# EAGLE design LACE_mod_hbridge (EAGLE 5.09)
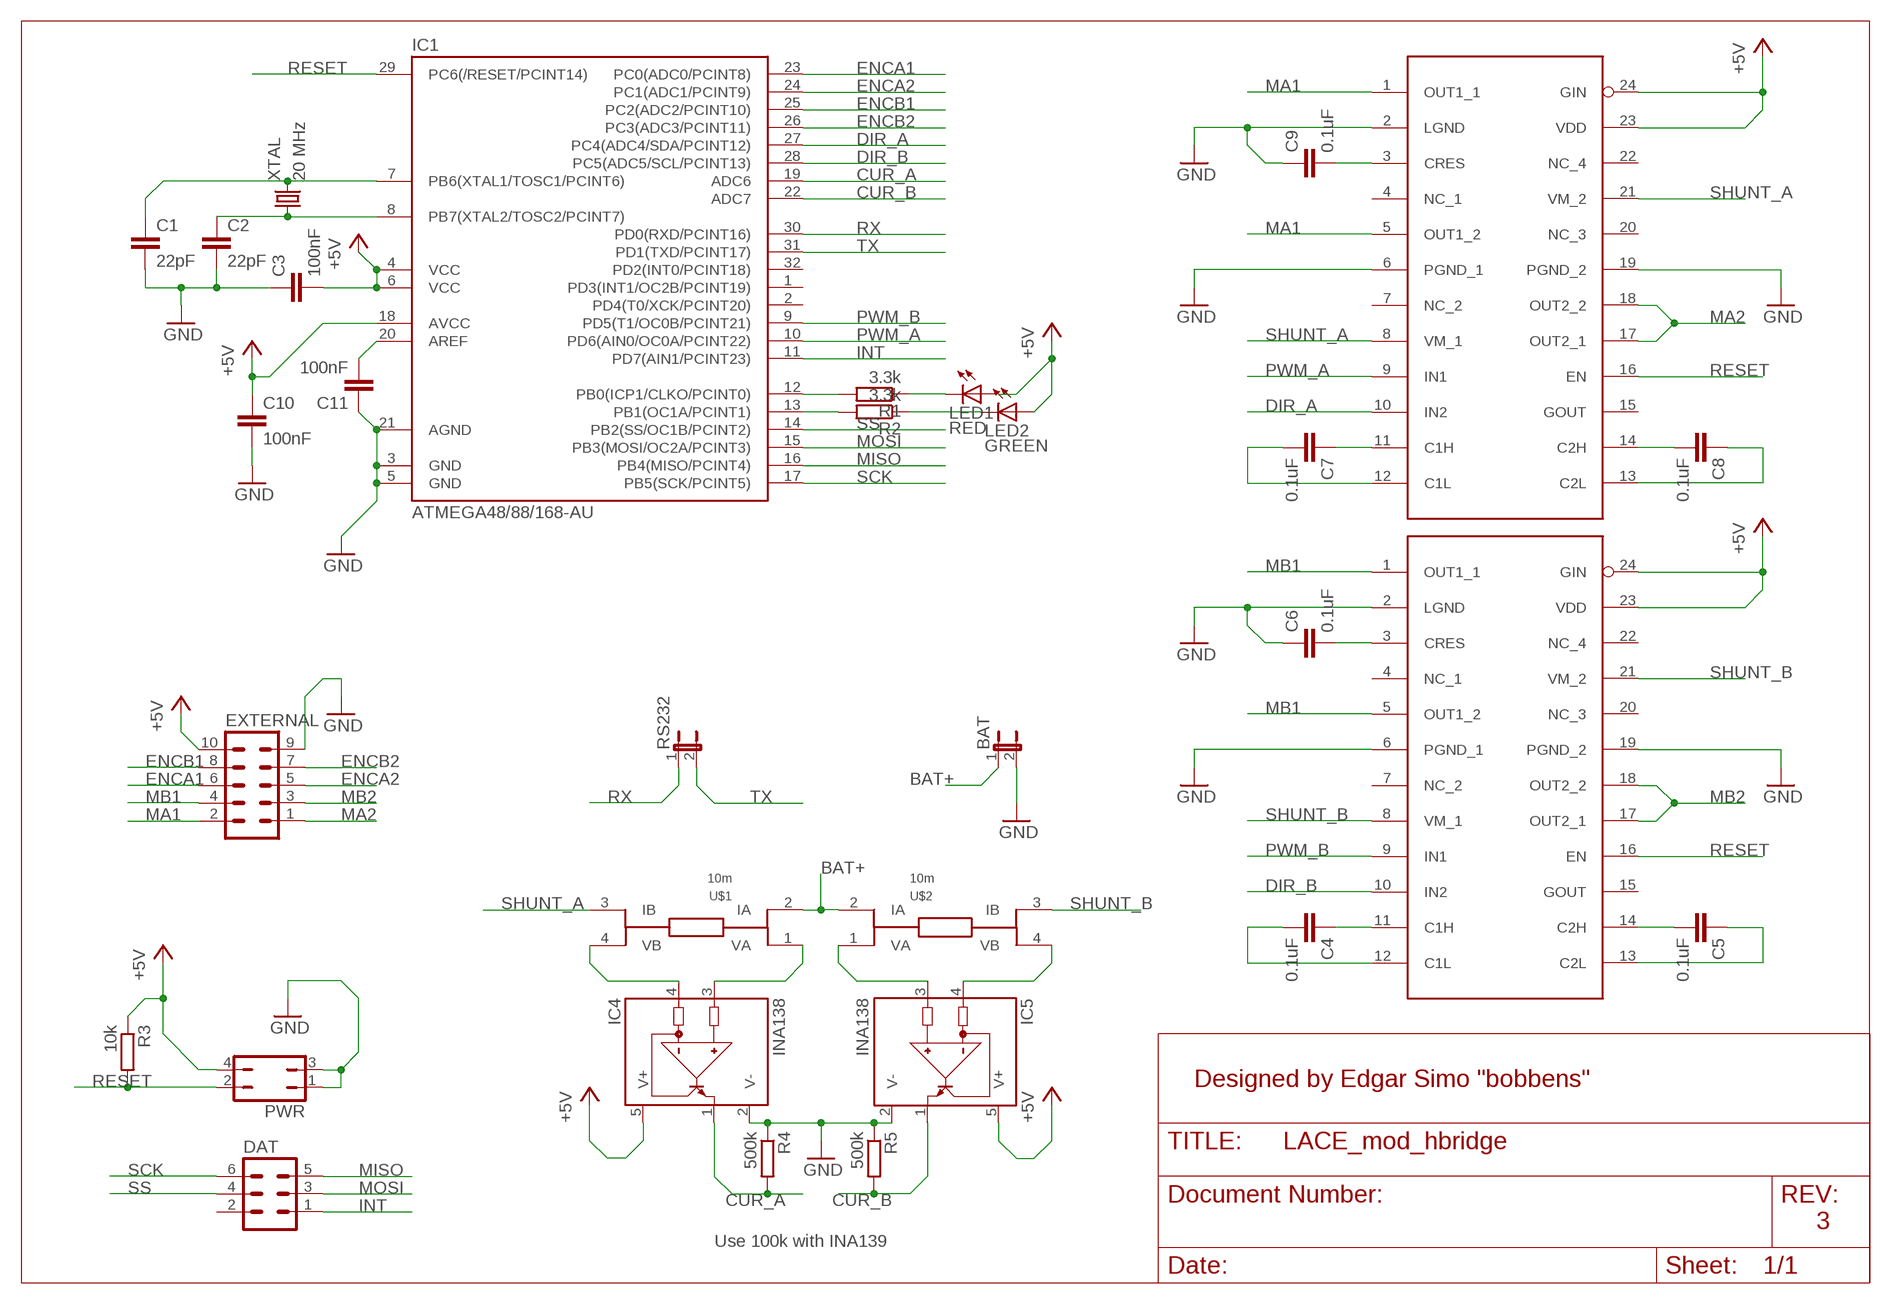
[diagram p0: schematic, sheet 1]

## Parts
BAT  JP1E  [JP1]
C1  22pF  C-EUC0805K  [C0805K]
C2  22pF  C-EUC0805K  [C0805K]
C3  100nF  C-EUC0805K  [C0805K]
C4  0.1uF  C-EUC0805K  [C0805K]
C5  0.1uF  C-EUC0805K  [C0805K]
C6  0.1uF  C-EUC0805K  [C0805K]
C7  0.1uF  C-EUC0805K  [C0805K]
C8  0.1uF  C-EUC0805K  [C0805K]
C9  0.1uF  C-EUC0805K  [C0805K]
C10  100nF  C-EUC0805K  [C0805K]
C11  100nF  C-EUC0805K  [C0805K]
DAT  MA03-2  [MA03-2]
EXTERNAL  MA05-2  [MA05-2]
IC1  ATMEGA48/88/168-AU  [TQFP32-08]
IC2  MPC17510  [TSSOP24]
IC3  MPC17510  [TSSOP24]
IC4  INA138  [SOT23-5]
IC5  INA138  [SOT23-5]
LED1  RED  LEDCHIPLED_0805  [CHIPLED_0805]
LED2  GREEN  LEDCHIPLED_0805  [CHIPLED_0805]
PWR  JP2Q  [JP2Q]
R1  3.3k  R-EU_R0805  [R0805]
R2  3.3k  R-EU_R0805  [R0805]
R3  10k  R-EU_R0805  [R0805]
R4  500k  R-EU_R0805  [R0805]
R5  500k  R-EU_R0805  [R0805]
RS232  JP1E  [JP1]
U$1  10m  LVK20R  [LVK20]
U$2  10m  LVK20R  [LVK20]
XTAL  20 MHz  CRYSTALHC49S  [HC49/S]

## Nets
+5V: C3.2 C10.1 EXTERNAL.10 IC1.4(VCC) IC1.6(VCC) IC1.18(AVCC) IC2.23(VDD) IC2.24(GIN) IC3.23(VDD) IC3.24(GIN) IC4.5(V+) IC5.5(V+) LED1.A LED2.A PWR.4 R3.1
BAT+: BAT.1 U$1.2(IA) U$2.2(IA)
CUR_A: IC1.19(ADC6) IC4.1(OUT) R4.2
CUR_B: IC1.22(ADC7) IC5.1(OUT) R5.2
DIR_A: IC1.27(PC4(ADC4/SDA/PCINT12)) IC2.10(IN2)
DIR_B: IC1.28(PC5(ADC5/SCL/PCINT13)) IC3.10(IN2)
ENCA1: EXTERNAL.6 IC1.23(PC0(ADC0/PCINT8))
ENCA2: EXTERNAL.5 IC1.24(PC1(ADC1/PCINT9))
ENCB1: EXTERNAL.8 IC1.25(PC2(ADC2/PCINT10))
ENCB2: EXTERNAL.7 IC1.26(PC3(ADC3/PCINT11))
GND: BAT.2 C1.2 C2.2 C3.1 C6.1 C9.1 C10.2 C11.1 EXTERNAL.9 IC1.3(GND) IC1.5(GND) IC1.21(AGND) IC2.2(LGND) IC2.6(PGND_1) IC2.19(PGND_2) IC3.2(LGND) IC3.6(PGND_1) IC3.19(PGND_2) IC4.2(V-) IC5.2(V-) PWR.1 PWR.3 R4.1 R5.1
INT: DAT.1 IC1.11(PD7(AIN1/PCINT23))
MA1: EXTERNAL.2 IC2.1(OUT1_1) IC2.5(OUT1_2)
MA2: EXTERNAL.1 IC2.17(OUT2_1) IC2.18(OUT2_2)
MB1: EXTERNAL.4 IC3.1(OUT1_1) IC3.5(OUT1_2)
MB2: EXTERNAL.3 IC3.17(OUT2_1) IC3.18(OUT2_2)
MISO: DAT.5 IC1.16(PB4(MISO/PCINT4))
MOSI: DAT.3 IC1.15(PB3(MOSI/OC2A/PCINT3))
N$1: C1.1 IC1.7(PB6(XTAL1/TOSC1/PCINT6)) XTAL.2
N$2: IC4.4(IN-) U$1.4(VB)
N$3: C7.1 IC2.11(C1H)
N$4: C7.2 IC2.12(C1L)
N$5: C8.2 IC2.14(C2H)
N$6: C8.1 IC2.13(C2L)
N$7: C4.1 IC3.11(C1H)
N$8: C9.2 IC2.3(CRES)
N$9: C4.2 IC3.12(C1L)
N$10: C5.2 IC3.14(C2H)
N$11: C5.1 IC3.13(C2L)
N$12: C6.2 IC3.3(CRES)
N$13: IC1.12(PB0(ICP1/CLKO/PCINT0)) R1.2
N$14: IC1.13(PB1(OC1A/PCINT1)) R2.2
N$15: LED1.C R1.1
N$16: LED2.C R2.1
N$17: IC4.3(IN+) U$1.1(VA)
N$18: IC5.3(IN+) U$2.1(VA)
N$19: IC5.4(IN-) U$2.4(VB)
N$22: C11.2 IC1.20(AREF)
N$24: C2.1 IC1.8(PB7(XTAL2/TOSC2/PCINT7)) XTAL.1
PWM_A: IC1.10(PD6(AIN0/OC0A/PCINT22)) IC2.9(IN1)
PWM_B: IC1.9(PD5(T1/OC0B/PCINT21)) IC3.9(IN1)
RESET: IC1.29(PC6(/RESET/PCINT14)) IC2.16(EN) IC3.16(EN) PWR.2 R3.2
RX: IC1.30(PD0(RXD/PCINT16)) RS232.1
SCK: DAT.6 IC1.17(PB5(SCK/PCINT5))
SHUNT_A: IC2.8(VM_1) IC2.21(VM_2) U$1.3(IB)
SHUNT_B: IC3.8(VM_1) IC3.21(VM_2) U$2.3(IB)
SS: DAT.4 IC1.14(PB2(SS/OC1B/PCINT2))
TX: IC1.31(PD1(TXD/PCINT17)) RS232.2
Unconnected: DAT.2 IC1.1(PD3(INT1/OC2B/PCINT19)) IC1.2(PD4(T0/XCK/PCINT20)) IC1.32(PD2(INT0/PCINT18)) IC2.4(NC_1) IC2.7(NC_2) IC2.15(GOUT) IC2.20(NC_3) IC2.22(NC_4) IC3.4(NC_1) IC3.7(NC_2) IC3.15(GOUT) IC3.20(NC_3) IC3.22(NC_4)

## Notes on the sheet
- Designed by Edgar Simo "bobbens"
- 3
- Use 100k with INA139

## Library data of the parts
BAT RS232 = jumper:JP1E: JUMPER
C1-C11 = rcl:C-EU: CAPACITOR, European symbol
DAT = con-lstb:MA03-2: PIN HEADER
EXTERNAL = con-lstb:MA05-2: PIN HEADER
IC1 = atmega8:ATMEGA48/88/168
IC2 IC3 = mpc17510:MPC17510
IC4 IC5 = burr-brown:INA138: High-Side Measurement Current Shunt Monitor
LED1 LED2 = led:LED: LED OSRAM: - CHIPLED LG R971, LG N971, LY N971, LG Q971, LY Q971, LO R971, LY R971 LH N974, LH R974 LS Q976, LO Q976, LY Q976 LO Q996 - Hyper CHIPLED LW Q18S LB Q993, LB Q99A, LB R99A - SideLED LS A670, LO A670, LY A670, LG A670, LP A670 LB A673, LV A673, LT A673, LW A673 LH A674 LY A675 LS A676, LA A676, LO A676, LY A676, LW A676 LS A679, LY A679, LG A679 - Hyper Micro SIDELED® LS Y876, LA Y876, LO Y876, LY Y876 LT Y87S - SmartLED LW L88C, LW L88S LB L89C, LB L89S, LG L890 LS L89K, LO L89K, LY L89K LS L896, LA L896, LO L896, LY L896 - TOPLED LS T670, LO T670, LY T670, LG T670, LP T670 LSG T670, LSP T670, LSY T670, LOP T670, LYG T670 LG T671, LOG T671, LSG T671 LB T673, LV T673, LT T673, LW T673 LH T674 LS T676, LA T676, LO T676, LY T676, LB T676, LH T676, LSB T676, LW T676 LB T67C, LV T67C, LT T67C, LS T67K, LO T67K, LY T67K, LW E67C LS E67B, LA E67B, LO E67B, LY E67B, LB E67C, LV E67C, LT E67C LW T67C LS T679, LY T679, LG T679 LS T770, LO T770, LY T770, LG T770, LP T770 LB T773, LV T773, LT T773, LW T773 LH T774 LS E675, LA E675, LY E675, LS T675 LS T776, LA T776, LO T776, LY T776, LB T776 LHGB T686 LT T68C, LB T68C - Hyper Mini TOPLED® LB M676 - Mini TOPLED Santana® LG M470 LS M47K, LO M47K, LY M47K Source: http://www.osram.convergy.de LUXEON: - LUMILED® LXK2-PW12-R00, LXK2-PW12-S00, LXK2-PW14-U00, LXK2-PW14-V00 LXK2-PM12-R00, LXK2-PM12-S00, LXK2-PM14-U00 LXK2-PE12-Q00, LXK2-PE12-R00, LXK2-PE12-S00, LXK2-PE14-T00, LXK2-PE14-U00 LXK2-PB12-K00, LXK2-PB12-L00, LXK2-PB12-M00, LXK2-PB14-N00, LXK2-PB14-P00, LXK2-PB14-Q00 LXK2-PR12-L00, LXK2-PR12-M00, LXK2-PR14-Q00, LXK2-PR14-R00 LXK2-PD12-Q00, LXK2-PD12-R00, LXK2-PD12-S00 LXK2-PH12-R00, LXK2-PH12-S00 LXK2-PL12-P00, LXK2-PL12-Q00, LXK2-PL12-R00 Source: www.luxeon.com KINGBRIGHT: KA-3528ASYC Source: www.kingbright.com
PWR = jumper:JP2Q: JUMPER
R1-R5 = rcl:R-EU_: RESISTOR, European symbol
U$1 U$2 = bobbens:LVK20R: Resistor Four Terminal High Precision Current Sense Kelvin Configuration
XTAL = crystal:CRYSTAL: CRYSTAL

## Board
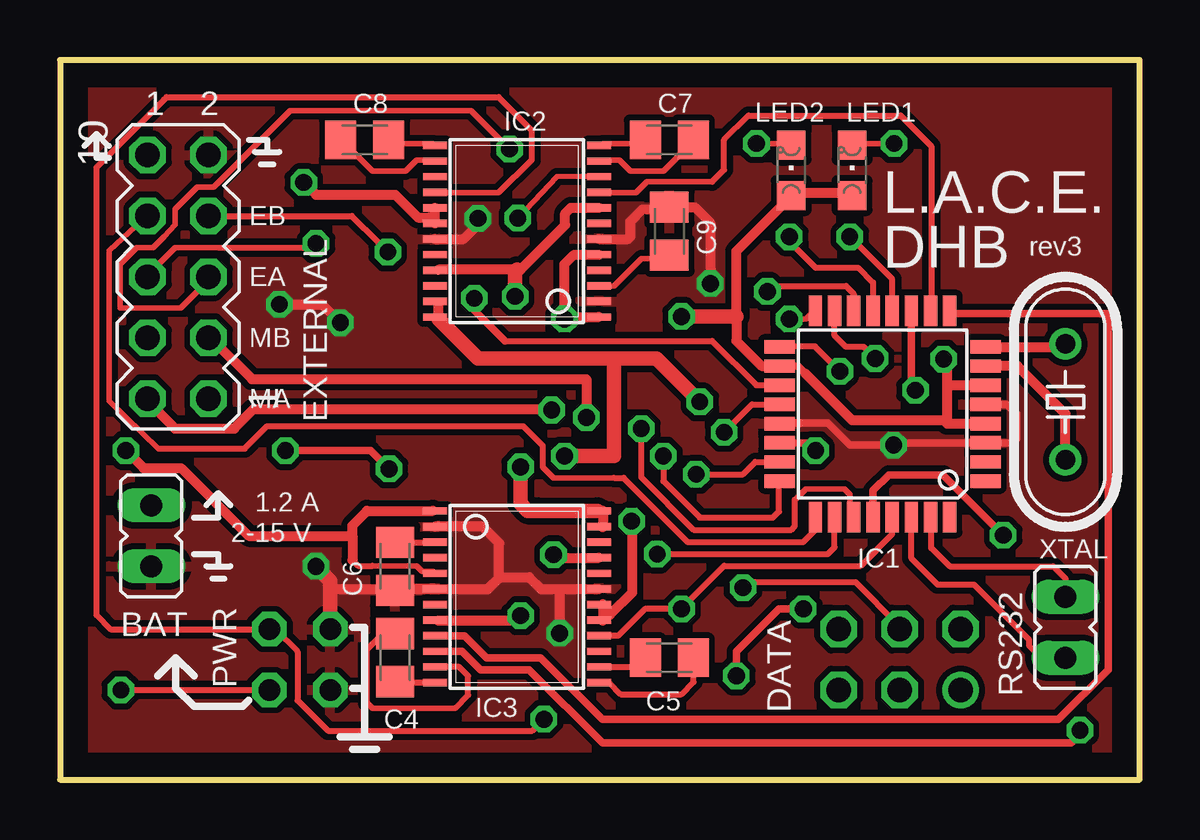
[diagram p1: board, top side]
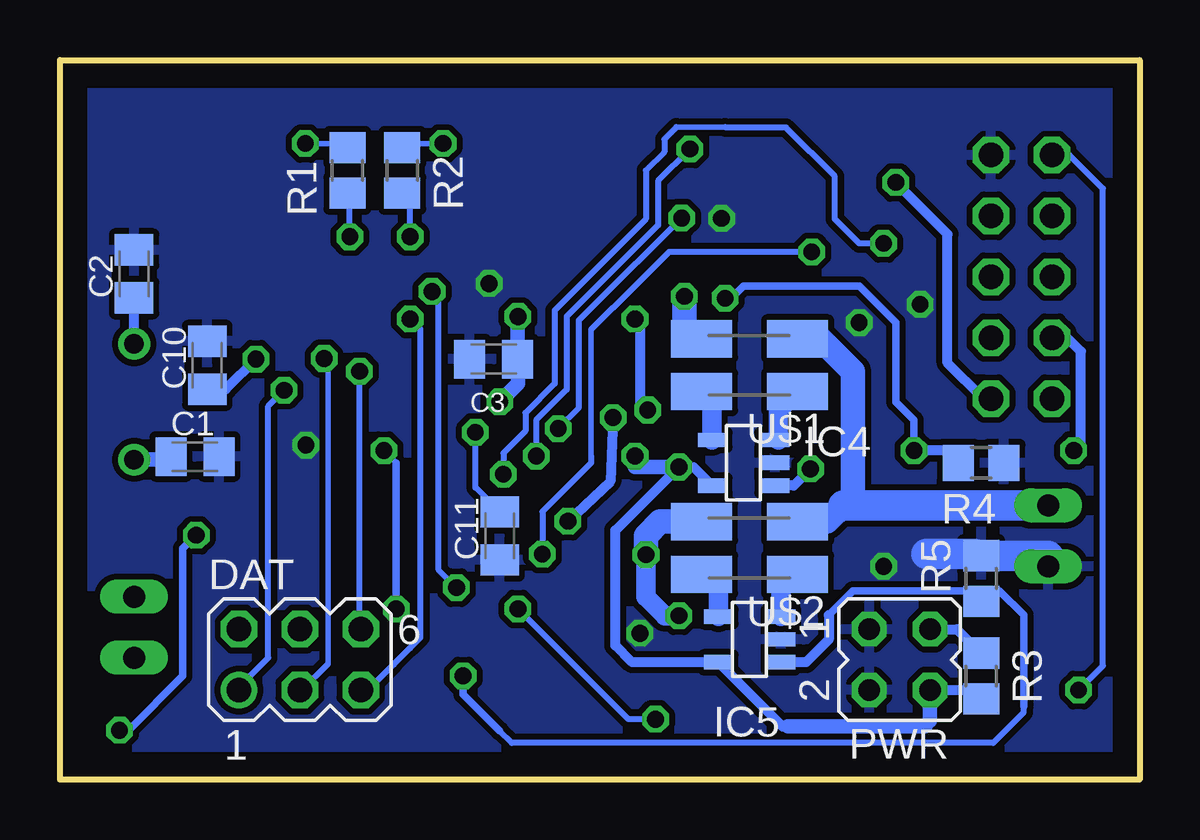
[diagram p2: board, bottom side, seen from below]

Size 45 x 30 mm. Coordinates in mm from the lower left corner, seen from the top.
Outline: 0,0 45,0 45,30 0,30 0,0
Copper layers (1*16): Top 0.035mm / dielectric 1.5mm / Bottom 0.035mm
Design rules "olimex-8mils *": minimum track width 8mil, minimum drill 0.7mm, track to track 8mil, track to pad 8mil, pad to pad 8mil, via to via 8mil, smd to smd 8mil, copper to edge 40mil, drill to drill 10mil, minimum pad ring 10mil, minimum via ring 8mil, stop-mask expansion 0mil, vias tented up to drill 0mil, thermal gap 10mil

### Footprints (pad centres in the part's own frame; a part is rotated, then mirrored left to right if it is on the bottom)
JP1 = drill 0.914 long: 1 0,-1.27; 2 0,1.27
C0805K = smd 1.3 x 1.6: 1 -1,0; 2 1,0
MA03-2 = drill 1.016 round: 1 -2.54,-1.27 | drill 1.016 octagon: 2 -2.54,1.27; 3 0,-1.27; 4 0,1.27; 5 2.54,-1.27; 6 2.54,1.27
MA05-2 = drill 1.016 octagon: 1 -5.08,-1.27; 2 -5.08,1.27; 3 -2.54,-1.27; 4 -2.54,1.27; 5 0,-1.27; 6 0,1.27; 7 2.54,-1.27; 8 2.54,1.27; 9 5.08,-1.27; 10 5.08,1.27
TQFP32-08 = smd 1.27 x 0.559: 1 -4.293,2.8; 2 -4.293,2; 3 -4.293,1.2; 4 -4.293,0.4; 5 -4.293,-0.4; 6 -4.293,-1.2; 7 -4.293,-2; 8 -4.293,-2.8; 17 4.293,-2.8; 18 4.293,-2; 19 4.293,-1.2; 20 4.293,-0.4; 21 4.293,0.4; 22 4.293,1.2; 23 4.293,2; 24 4.293,2.8 | smd 0.559 x 1.27: 9 -2.8,-4.293; 10 -2,-4.293; 11 -1.2,-4.293; 12 -0.4,-4.293; 13 0.4,-4.293; 14 1.2,-4.293; 15 2,-4.293; 16 2.8,-4.293; 25 2.8,4.293; 26 2,4.293; 27 1.2,4.293; 28 0.4,4.293; 29 -0.4,4.293; 30 -1.2,4.293; 31 -2,4.293; 32 -2.8,4.293
TSSOP24 = smd 0.305 x 0.991: 1 -3.575,-3.418; 2 -2.925,-3.418; 3 -2.275,-3.418; 4 -1.625,-3.418; 5 -0.975,-3.418; 6 -0.325,-3.418; 7 0.325,-3.418; 8 0.975,-3.418; 9 1.625,-3.418; 10 2.275,-3.418; 11 2.925,-3.418; 12 3.575,-3.418; 13 3.575,3.418; 14 2.925,3.418; 15 2.275,3.418; 16 1.625,3.418; 17 0.975,3.418; 18 0.325,3.418; 19 -0.325,3.418; 20 -0.975,3.418; 21 -1.625,3.418; 22 -2.275,3.418; 23 -2.925,3.418; 24 -3.575,3.418
SOT23-5 = smd 0.6 x 1.2: 1 -0.95,-1.306; 2 0,-1.306; 3 0.95,-1.306; 4 0.95,1.306; 5 -0.95,1.306
CHIPLED_0805 = smd 1.2 x 1.2: A 0,-1.05; C 0,1.05
JP2Q = drill 0.914 octagon: 1 -1.27,-1.27; 2 -1.27,1.27; 3 1.27,-1.27; 4 1.27,1.27
R0805 = smd 1.3 x 1.5: 1 -0.95,0; 2 0.95,0
LVK20 = smd 2.55 x 1.55: 1 -2,1.1; 2 -2,-1.1; 3 2,-1.1; 4 2,1.1
HC49/S = drill 0.813 round: 1 -2.413,0; 2 2.413,0

### Placement (x,y rotation side)
BAT  3.81,10.16 180 top
C1  39.37,13.46 0 bottom
C2  41.91,21.08 90 bottom
C3  26.92,17.53 0 bottom
C4  13.97,5.08 270 top
C5  25.4,5.08 180 top
C6  13.97,8.89 90 top
C7  25.4,26.67 180 top
C8  12.7,26.67 180 top
C9  25.4,22.86 270 top
C10  38.86,17.27 90 bottom
C11  26.67,10.16 90 bottom
DAT  35,5 0 bottom
EXTERNAL  4.92,20.96 90 top
IC1  34.29,15.24 180 top
IC2  19.05,22.86 90 top
IC3  19.05,7.62 270 top
IC4  16.51,13.21 90 bottom
IC5  16.26,5.84 90 bottom
LED1  33.02,25.4 0 top
LED2  30.48,25.4 0 top
PWR  10,5 270 bottom
R1  33.02,25.4 270 bottom
R2  30.73,25.4 270 bottom
R3  6.6,4.32 90 bottom
R4  6.6,13.21 180 bottom
R5  6.6,8.38 270 bottom
RS232  41.91,6.35 0 top
U$1  16.26,17.27 180 bottom
U$2  16.26,9.65 180 bottom
XTAL  41.91,15.75 270 top

### Tracks (layer width: path | path; a pad name or v marks a point on that pad's centre or on a via)
+5V  (via drill 0.7)
  Top 0.229: 30.63,24.46 LED2.A 30.4,24.23 | 32.92,24.46 LED1.A 33.15,24.23 | 22.63,10.52 IC3.23 | 22.4,11.2 IC3.24 | 15.77,19.43 IC2.24 15.77,19.2 | 15.77,19.89 IC2.23
  Top 0.254: v2.54,3.73 PWR.4
  Top 0.305: IC1.6 38.41,16.46 | 31.09,16.92 30.77,17.24 IC1.18
  Top 0.406: 30.63,24.46 32.92,24.46 | 22.63,10.52 22.63,11.2 IC3.24 | 15.77,19.43 15.77,19.89 | 19.88,11.21 19.89,11.2 | v19.2,13.03 | 23.07,13.49 23.08,13.5 | 30.4,24.23 28.19,22.02 28.19,19.3 28.19,18.29 29.24,17.24 IC1.18 | 36.83,14.99 36.98,14.99 36.98,16.51 | 31.09,16.92 33.02,14.99 36.83,14.99 | 36.98,16.51 36.98,17.37 v36.83,17.53 | IC1.6 37.05,16.44 36.98,16.51 | IC1.4 36.98,14.84 36.83,14.99
  Top 0.61: 23.11,17.55 17.43,17.55 15.77,19.2 | 19.89,11.2 22.4,11.2 | 19.88,11.21 19.5,11.21 19.2,11.5 v19.2,13.03 | v21.03,13.49 23.07,13.49 | 23.08,13.5 23.08,17.52 23.11,17.55 | 23.11,17.55 24.87,17.55 v26.67,15.75 | v25.91,19.3 28.19,19.3
  Bottom 0.254: EXTERNAL.10 2.93,26.04 1.52,24.64 1.52,4.75 v2.54,3.73 | 25.92,19.29 v25.91,19.3
  Bottom 0.406: IC4.5 18.59,13.03 v19.2,13.03 21.84,10.39 21.84,5.59 21.15,4.89 IC5.5 14.88,2.21 14.65,2.21 | PWR.4 6.97,3.73 R3.1 | C10.1 38.08,16.27 v36.83,17.53
  Bottom 0.61: v19.2,13.03 21.03,13.03 v21.03,13.49 | 14.65,2.21 14.58,2.21 8.95,2.22 8.73,2.44 PWR.4 | v26.67,15.75 25.91,16.51 25.91,17.51 C3.2 25.92,19.29
BAT+
  Bottom 0.406: 12.19,11.43 11.94,11.68
  Bottom 1.016: U$1.2 13.29,18.37 11.94,17.02 11.94,11.68 | U$2.2 13.02,10.75 12.34,11.43
  Bottom 1.27: BAT.1 12.19,11.43 12.34,11.43
CUR_A  (via drill 0.7)
  Top 0.254: 18.54,18.29 27.18,18.29 29.03,16.44 IC1.19
  Top 0.305: v17.27,20.07 17.27,19.56 18.54,18.29 | v9.4,13.72 12.95,13.72 v13.72,12.95
  Bottom 0.305: v17.27,20.07 17.02,20.07 16.51,20.57 11.68,20.57 10.16,19.05 10.16,15.75 9.4,14.99 v9.4,13.72
  Bottom 0.406: v9.4,13.72 7.55,13.72 R4.2 | IC4.1 14.41,12.26 v13.72,12.95
CUR_B  (via drill 0.7)
  Top 0.305: v28.19,4.32 28.19,5.33 29.97,7.11 v30.99,7.11 | IC1.22 31.17,14.04 v31.5,13.72
  Bottom 0.254: 30.99,13.21 v31.5,13.72 | 4.83,3.05 4.83,2.79 6.1,1.52 26.16,1.52 26.67,2.03
  Bottom 0.305: 4.83,3.05 4.83,6.86 5.84,7.87 6.6,7.87 11.94,7.87 12.95,6.86 | 26.67,2.03 28.19,3.56 v28.19,4.32 | v30.99,7.11 30.99,13.21
  Bottom 0.406: 6.6,7.87 R5.2 | 12.95,6.86 12.95,5.84 13.9,4.89 IC5.1
DIR_A  (via drill 0.7)
  Top 0.229: v19.09,23.41 20.72,25.13 22.4,25.15 IC2.10 | 30.63,11.66 30.95,11.98 31.09,12.12 32.69,12.12 32.92,11.89 32.92,10.97 IC1.27
  Top 0.254: v24.23,14.63 24.23,12.6 26.42,10.41 30.48,10.41 30.63,10.57 30.63,11.66 | 30.95,11.98 30.66,11.68
  Bottom 0.254: v19.09,23.41 22.86,19.66 23.37,19.15 23.37,15.49 v24.23,14.63
DIR_B  (via drill 0.7)
  Top 0.254: 36.83,12.68 36.83,12.7
  Top 0.305: v42.52,2.06 42.52,1.88 42.16,1.52 22.61,1.52 19.56,4.57 17.53,4.57 16.75,5.34 IC3.10 | IC1.28 33.89,12.05 34.54,12.7 36.83,12.7 | v39.32,10.19 36.83,12.68
  Bottom 0.305: v42.52,2.06 42.14,2.06 39.88,4.32 39.88,9.63 v39.32,10.19
ENCA1  (via drill 0.7)
  Top 0.229: 6.63,22.17 4.8,22.17 3.66,21.03 EXTERNAL.6 | IC1.23 29.95,13.26
  Top 0.254: 6.63,22.17 10.49,22.17 v10.67,22.35 | 29.96,13.21 IC1.23 28.99,13.24 28.47,12.72 v26.52,12.72
  Bottom 0.229: 17.27,27.2 19.3,27.2
  Bottom 0.254: 17.27,27.2 17.25,27.18 14.73,27.18 12.7,25.15 12.7,23.37 11.68,22.35 v10.67,22.35 | 19.3,27.2 19.81,26.7 19.81,26.16 20.57,25.4 20.57,23.37 24.38,19.56 24.38,16.51 25.6,15.29 25.6,14.53 26.52,13.61 v26.52,12.72
ENCA2  (via drill 0.7)
  Top 0.229: v18.75,26.29 17.14,27.89 9.6,27.89 6.4,24.69 5.71,24.69 4.8,23.77 4.8,23.14 4.34,22.63 3.89,22.17 3.2,22.17 2.52,21.49 2.52,19.66 5.03,19.66 6.17,20.8 EXTERNAL.5 | IC1.24 29.95,12.57
  Top 0.254: v25.15,13.49 25.15,12.45 26.67,10.92 29.72,10.92 29.97,11.18 29.97,12.41 IC1.24
  Bottom 0.254: v25.15,13.49 25.15,14.99 23.88,16.26 23.88,19.3 20.07,23.11 20.07,24.97 v18.75,26.29
ENCB1
  Top 0.229: 23.09,12.57 20.57,12.57 20.12,13.03 | 4.12,13.79 2.06,15.77 2.06,22.05 3.43,23.32 EXTERNAL.8 | IC1.25 31.32,10.74
  Top 0.254: 4.12,13.79 4.13,13.79 7.7,13.79 8.64,14.73 19.3,14.73 20.12,13.92 20.12,13.03 | 31.46,10.92 IC1.25 31.49,10.41 30.99,9.91 26.16,9.91 23.5,12.57 23.09,12.57
ENCB2  (via drill 0.7)
  Top 0.229: 13.26,22.4 v13.66,22
  Top 0.254: EXTERNAL.7 12.16,23.5 13.26,22.4 | IC1.26 32.29,9.68 32,9.4 v24.89,9.4
  Bottom 0.229: 22.86,13.49 22.86,18.77 21.95,19.68 21.95,19.66 20.12,21.49
  Bottom 0.254: v13.66,22 19.61,22 20.12,21.49 | 22.86,13.49 22.86,13.21 24.89,11.18 v24.89,9.4
GND  (via drill 0.7)
  Top 0.229: 29.95,14.86 IC1.21 30.18,14.86 | C6.1 14.17,8 | 17.91,8 16.92,8 | 25.38,23.77 C9.1
  Top 0.254: 24.28,23.77 24.46,23.77
  Top 0.305: 30.18,14.86 32,14.86 32.92,13.95 v34.75,13.95 34.84,14.04 IC1.3 39.69,14.04 39.88,14.22 39.88,15.24 39.48,15.64 IC1.5
  Top 0.406: 24.46,23.77 25.38,23.77 | IC3.6 14.03,7.95 C6.1 | IC3.6 17.86,7.95 17.91,8 18.35,8.43 | C9.1 26.46,23.86 27.11,23.21 v27.11,20.68 | IC2.19 16.82,22.54 17.42,23.14 v17.42,23.39 | 20.83,7.95 20.05,7.95 19.56,8.43 18.35,8.43 | 20.83,7.95 IC3.19 | IC3.2 17.62,10.54 18.3,9.86 18.3,8.48 18.35,8.43 | 11.27,8.29 11.27,8.13 11.45,7.95 IC3.6 | IC2.6 23.68,22.54 23.77,22.63 23.77,23.27 24.28,23.77 | 20.83,7.95 v20.83,6.1 | v9.14,19.81 10.92,19.81 v11.68,19.05
  Top 0.61: PWR.1 11.27,8.13 | 11.27,8.29 v10.67,8.89
  Bottom 0.406: BAT.2 3.81,9.33
  Bottom 1.27: 3.81,9.33 R5.1 | 6.86,9.4 8.89,9.4
  pour Bottom (isolate 0.254): 0,30.48 45.72,30.48 45.72,0 0.25,0
  pour Top (isolate 0.254): -0.76,30.99 44.96,30.99 44.96,0.25 -0.25,0.25 -0.25,0.76
INT  (via drill 0.7)
  Top 0.305: IC1.11 35.49,16.4 v35.66,16.23
  Bottom 0.254: DAT.1 37.54,3.86 36.32,5.08 36.32,15.57 v35.66,16.23
MA1  (via drill 0.7)
  Top 0.254: 20.45,15.45 v20.5,15.41
  Top 0.406: EXTERNAL.2 3.66,15.77 4.8,14.63 7.26,14.63 8.08,15.45 20.45,15.45 | IC2.1 21.11,19.29 v21.03,19.2 21.03,21.49 21.43,21.89 IC2.5
  Bottom 0.406: v21.03,19.2 20.8,18.97 20.8,15.75 v20.5,15.41
MA2  (via drill 0.7)
  Top 0.406: IC2.17 IC2.18 15.39,23.43 14.93,23.43 13.97,24.38 10.67,24.38 v10.16,24.89
  Bottom 0.406: EXTERNAL.1 6.51,15.88 8,17.37 8,22.73 v10.16,24.89
MB1  (via drill 0.7)
  Top 0.229: 13.03,8.91 14.86,8.91 15.09,8.69 15.54,8.69 IC3.5 | 15.54,11.2 IC3.1
  Top 0.254: 13.03,8.91 12.42,8.91 12.19,9.14
  Top 0.406: 15.54,11.2 12.8,11.2 12.19,10.59 12.19,10.16 | v2.74,13.72 2.75,13.72 3.48,12.99 5.05,12.99 7.87,10.16 12.19,10.16 | 12.19,10.16 12.19,9.14
  Bottom 0.406: v2.74,13.72 2.45,13.96 2.45,17.85 3.02,18.42 EXTERNAL.4
MB2  (via drill 0.7)
  Top 0.229: 22.63,6.63 IC3.17 | 22.63,7.32 IC3.18
  Top 0.406: 22.63,6.63 22.63,7.32 22.93,6.88 23.84,7.79 23.84,10.45 v23.82,10.77 | v21.95,15.09 21.95,16.69 8,16.69 6.4,18.29 EXTERNAL.3
  Bottom 0.406: v23.82,10.77 22.06,12.43 v21.95,15.09
MISO  (via drill 0.7)
  Top 0.229: v30.4,19.2 31.09,19.2 31.32,19.43 IC1.16
  Bottom 0.229: 31.09,4.8 30.4,5.49
  Bottom 0.254: DAT.5 32.16,3.73 31.09,4.8 | v30.4,19.2 30.38,19.2 29.97,18.8 29.97,5.92 30.4,5.49
MOSI  (via drill 0.7)
  Top 0.254: IC1.15 32.29,18.51 32.77,18.03 33.5,18.03 v33.98,17.55
  Bottom 0.229: 33.83,4.83 33.83,17.14
  Bottom 0.254: DAT.3 34.93,3.73 33.83,4.83 | 33.83,17.7 v33.98,17.55 33.83,17.4 33.83,17.14
N$1
  Top 0.406: IC1.7 39.91,17.24 41.91,15.24 XTAL.2
  Bottom 0.406: C1.1 40.5,13.34
  Bottom 0.61: 40.5,13.34 XTAL.2
N$2
  Bottom 0.813: IC4.4 17.82,15.73 U$1.4
N$3
  Top 0.229: IC2.11 22.63,25.83 23.32,25.83 23.77,25.38 25.15,25.38 26.29,26.52 C7.1
N$4
  Top 0.229: IC2.12 22.63,26.52 24.23,26.52 C7.2
N$5
  Top 0.229: IC2.14 15.54,25.83 14.86,25.83 14.4,25.38 13.03,25.38 11.89,26.52 C8.2
N$6
  Top 0.229: IC2.13 15.54,26.52 13.72,26.52 C8.1
N$7
  Top 0.229: 16.46,2.97 13.03,2.97 12.8,3.2
  Top 0.254: IC3.11 16.64,4.7 17.02,4.32 17.02,3.53 16.46,2.97 | 12.8,3.2 12.8,5.44 13.46,6.1 13.95,6.1 C4.1
N$8
  Top 0.229: IC2.3 22.63,20.57 23.09,20.57 24.23,21.72 25.38,21.72 C9.2
N$9
  Top 0.229: C4.2 14.17,4.12
  Top 0.254: IC3.12 14.01,4.04 C4.2
N$10
  Top 0.254: IC3.14 24.02,4.7 C5.2
N$11
  Top 0.254: IC3.13 22.88,4.04 23.37,3.56 25.91,3.56 26.42,4.06 26.42,5.06 C5.1
N$12
  Top 0.254: IC3.3 C6.2
N$13  (via drill 0.7)
  Top 0.254: IC1.12 34.69,20.86 v32.92,22.63
  Bottom 0.229: R1.2 32.92,24.23
  Bottom 0.254: v32.92,22.63 32.92,24.35 R1.2
N$14  (via drill 0.7)
  Top 0.229: IC1.13 33.83,19.66
  Top 0.254: v30.4,22.63 30.4,22.43 31.5,21.34 33.27,21.34 33.89,20.72 IC1.13
  Bottom 0.229: R2.2 30.4,24.23
  Bottom 0.254: v30.4,22.63 30.4,24.12 R2.2
N$15  (via drill 0.7)
  Top 0.229: v34.77,26.52 33.15,26.52 LED1.C
  Bottom 0.229: v34.77,26.52 33.15,26.52 R1.1
N$16  (via drill 0.7)
  Top 0.229: v29.03,26.52 30.4,26.52 LED2.C
  Bottom 0.229: v29.03,26.52 30.4,26.52 R2.1
N$17
  Bottom 0.406: IC4.3 15.05,14.16
  Bottom 0.813: 15.05,14.16 15.05,15.38 U$1.1
N$18
  Bottom 0.406: 14.95,7.86 U$2.1
  Bottom 0.813: IC5.3 14.95,7.86
N$19
  Bottom 0.406: 17.56,7.86 U$2.4
  Bottom 0.813: IC5.4 17.56,7.86
N$22  (via drill 0.7)
  Top 0.254: IC1.20 28.85,15.64 v27.69,14.48
  Bottom 0.254: v27.69,14.48 27.69,12.18 C11.2
N$24
  Top 0.406: IC1.8 41.91,18.04 XTAL.1
  Bottom 0.406: XTAL.1 C2.1
PWM_A
  Top 0.229: 27.18,24.92 24.46,24.92 24,24.46 22.63,24.46 IC2.9 | 36.35,20.34 36.35,19.66 IC1.10
  Top 0.254: IC1.10 36.32,19.57 36.32,26.42 35.05,27.69 28.7,27.69 27.69,26.67 27.69,25.43 27.18,24.92
PWM_B
  Top 0.229: 37.26,19.43 IC1.9
  Top 0.305: 37.26,19.43 43.69,19.43 43.69,4.57 41.6,2.52 22.61,2.52 20.04,5.08 17.78,5.08 16.86,6 IC3.9
RESET  (via drill 0.7)
  Top 0.229: 19.66,25.83 18.29,24.46 15.77,24.46 IC2.16 | 1.6,25.6 4.34,28.35
  Top 0.254: IC3.16 23.27,6 24.38,7.11 v25.91,7.11 25.91,7.14 27.69,8.91 33.38,8.91 34.69,10.23 IC1.29 | v20.18,2.52 19.69,2.03 11.18,2.03 9.91,3.3 9.91,5.33 8.97,6.27 PWR.2 2.11,6.27 1.52,6.86 1.52,25.53 1.6,25.6 | 19.66,25.83 19.66,27.08 18.29,28.45 4.45,28.45 4.34,28.35
  Bottom 0.254: v20.18,2.52 21.31,2.52 v25.91,7.11
  Bottom 0.406: PWR.2 7.61,6.27 R3.2
RX
  Top 0.254: IC1.30 35.49,9.21 36.58,8.13 38.1,8.13 40.39,5.84 40.39,5.59 40.89,5.08 RS232.1
SCK  (via drill 0.7)
  Top 0.229: 30.18,18.06 IC1.17
  Top 0.254: 30.18,18.06 31.47,18.06 v32.51,17.02
  Bottom 0.229: DAT.6 32.46,6.4
  Bottom 0.254: 32.46,6.4 32.46,6.55 32.51,6.6 v32.51,17.02
SHUNT_A  (via drill 0.7)
  Top 0.229: 15.77,21.26 IC2.21
  Top 0.406: IC2.8 21.3,23.84 21.06,23.6 21.06,23.12 19.2,21.26 19.05,21.26 15.77,21.26
  Top 0.61: v18.97,20.14 18.97,21.18 19.05,21.26
  Bottom 0.229: 18.97,18.57 18.75,17.83
  Bottom 0.406: U$1.3 18.89,18.37 18.97,18.29
  Bottom 1.016: v18.97,20.14 18.97,18.57 18.97,18.29
SHUNT_B  (via drill 0.7)
  Top 0.229: IC3.8 15.77,6.63
  Top 0.406: 15.77,6.63 18.75,6.63 v19.2,6.83 | IC3.21 20.7,9.24 v20.57,9.37
  Bottom 0.813: v20.57,9.37 20.57,7.62 19.79,6.83 v19.2,6.83
  Bottom 1.016: U$2.3 19.98,10.75 20.57,10.16 v20.57,9.37
SS  (via drill 0.7)
  Top 0.229: 33.15,8.23 34.98,6.4 DAT.4
  Top 0.254: 33.15,8.23 28.7,8.23 v28.47,8 | IC1.14 33.09,20.25 32.77,20.57 29.72,20.57 v29.49,20.34
  Bottom 0.254: v29.49,20.34 29.21,20.07 29.21,8.74 v28.47,8
TX
  Top 0.254: RS232.2 41.91,8.38 41.4,8.89 37.08,8.89 36.32,9.65 36.32,10.91 IC1.31

### Text on the board
tNames: 1 | 2 | L.A.C.E. | EB | rev3 | EA | DHB | MB | MA | 1.2 A | 2-15 V | PWR | DATA